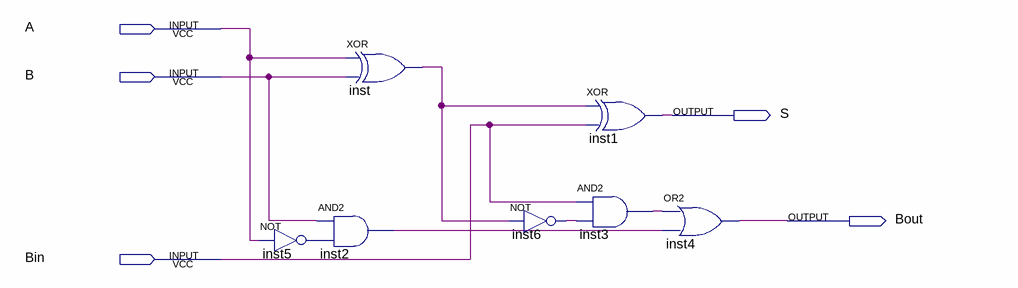
[diagram p0: schematic sheet]
// Quartus schematic FA_CERTO.bdf as structural Verilog: 7 symbols, 5 pins
module FA_CERTO (
  input  A,
  input  B,
  input  Bin,
  output S,
  output Bout
);

  wire inst2_out, inst3_out, inst5_out, inst6_out, inst_out;

  not inst5 (inst5_out, A);
  xor inst (inst_out, A, B);
  and inst2 (inst2_out, B, inst5_out);
  not inst6 (inst6_out, inst_out);
  xor inst1 (S, inst_out, Bin);
  and inst3 (inst3_out, Bin, inst6_out);
  or inst4 (Bout, inst3_out, inst2_out);
endmodule
